# EAGLE design exp31ac (EAGLE 7.7.0)
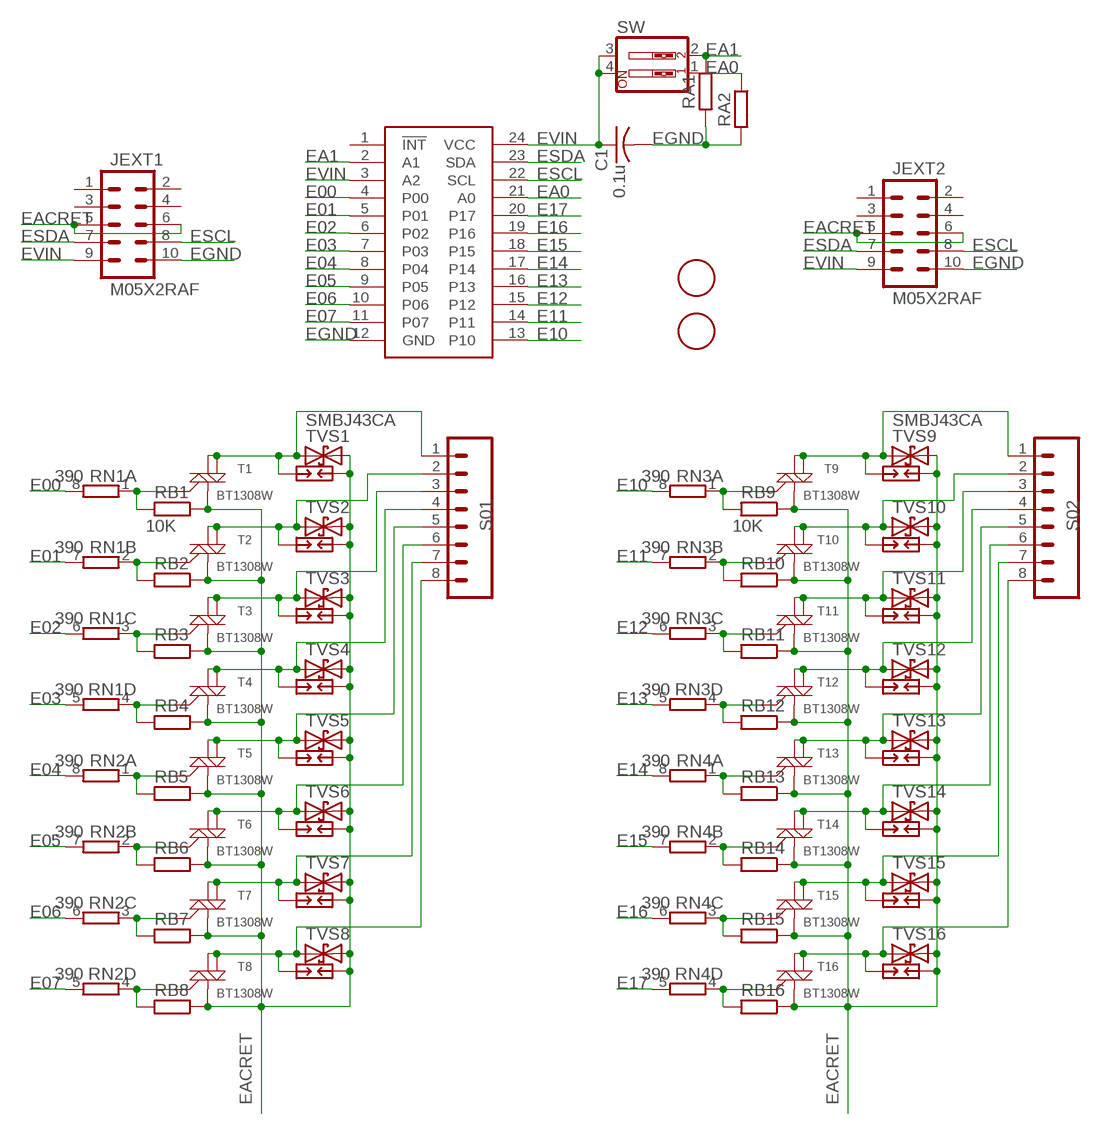
[diagram p0: schematic, sheet 1]

## Parts
C1  0.1u  C-USC0603  [C0603]
JEXT1  M05X2RAF  [2X5-RAF]
JEXT2  M05X2RAF  [2X5-RAF]
PCA9555  PCA9555PW  PCF8575TSSOP24  [TSSOP24]
RA1  10K  R-EU_R0603  [R0603]
RA2  10K  R-EU_R0603  [R0603]
RB1  10K  R-EU_R0603  [R0603]
RB2  10K  R-EU_R0603  [R0603]
RB3  10K  R-EU_R0603  [R0603]
RB4  10K  R-EU_R0603  [R0603]
RB5  10K  R-EU_R0603  [R0603]
RB6  10K  R-EU_R0603  [R0603]
RB7  10K  R-EU_R0603  [R0603]
RB8  10K  R-EU_R0603  [R0603]
RB9  10K  R-EU_R0603  [R0603]
RB10  10K  R-EU_R0603  [R0603]
RB11  10K  R-EU_R0603  [R0603]
RB12  10K  R-EU_R0603  [R0603]
RB13  10K  R-EU_R0603  [R0603]
RB14  10K  R-EU_R0603  [R0603]
RB15  10K  R-EU_R0603  [R0603]
RB16  10K  R-EU_R0603  [R0603]
RN1  390  4R-NEXB38V  [EXB38V]
RN2  390  4R-NEXB38V  [EXB38V]
RN3  390  4R-NEXB38V  [EXB38V]
RN4  390  4R-NEXB38V  [EXB38V]
S01  M085MM-8  [SCREWTERMINAL-5MM-8]
S02  M085MM-8  [SCREWTERMINAL-5MM-8]
SP1  PCB-SGAP  [PCB-SGAP]
SP2  PCB-SGAP  [PCB-SGAP]
SP3  PCB-SGAP  [PCB-SGAP]
SP4  PCB-SGAP  [PCB-SGAP]
SP5  PCB-SGAP  [PCB-SGAP]
SP6  PCB-SGAP  [PCB-SGAP]
SP7  PCB-SGAP  [PCB-SGAP]
SP8  PCB-SGAP  [PCB-SGAP]
SP9  PCB-SGAP  [PCB-SGAP]
SP10  PCB-SGAP  [PCB-SGAP]
SP11  PCB-SGAP  [PCB-SGAP]
SP12  PCB-SGAP  [PCB-SGAP]
SP13  PCB-SGAP  [PCB-SGAP]
SP14  PCB-SGAP  [PCB-SGAP]
SP15  PCB-SGAP  [PCB-SGAP]
SP16  PCB-SGAP  [PCB-SGAP]
SW  SW_DIP-2  [DIPSWITCH-02]
T1  BT1308W  MAC97SOT223  [SOT223]
T2  BT1308W  MAC97SOT223  [SOT223]
T3  BT1308W  MAC97SOT223  [SOT223]
T4  BT1308W  MAC97SOT223  [SOT223]
T5  BT1308W  MAC97SOT223  [SOT223]
T6  BT1308W  MAC97SOT223  [SOT223]
T7  BT1308W  MAC97SOT223  [SOT223]
T8  BT1308W  MAC97SOT223  [SOT223]
T9  BT1308W  MAC97SOT223  [SOT223]
T10  BT1308W  MAC97SOT223  [SOT223]
T11  BT1308W  MAC97SOT223  [SOT223]
T12  BT1308W  MAC97SOT223  [SOT223]
T13  BT1308W  MAC97SOT223  [SOT223]
T14  BT1308W  MAC97SOT223  [SOT223]
T15  BT1308W  MAC97SOT223  [SOT223]
T16  BT1308W  MAC97SOT223  [SOT223]
TVS1  SMBJ43CA  TVSSMB  [SMB]
TVS2  SMBJ43CA  TVSSMB  [SMB]
TVS3  SMBJ43CA  TVSSMB  [SMB]
TVS4  SMBJ43CA  TVSSMB  [SMB]
TVS5  SMBJ43CA  TVSSMB  [SMB]
TVS6  SMBJ43CA  TVSSMB  [SMB]
TVS7  SMBJ43CA  TVSSMB  [SMB]
TVS8  SMBJ43CA  TVSSMB  [SMB]
TVS9  SMBJ43CA  TVSSMB  [SMB]
TVS10  SMBJ43CA  TVSSMB  [SMB]
TVS11  SMBJ43CA  TVSSMB  [SMB]
TVS12  SMBJ43CA  TVSSMB  [SMB]
TVS13  SMBJ43CA  TVSSMB  [SMB]
TVS14  SMBJ43CA  TVSSMB  [SMB]
TVS15  SMBJ43CA  TVSSMB  [SMB]
TVS16  SMBJ43CA  TVSSMB  [SMB]
U$1  FIDUCIAL  [FIDUCIAL_1MM]
U$2  FIDUCIAL  [FIDUCIAL_1MM]

## Nets
E00: PCA9555.4(P00) RN1.8
E01: PCA9555.5(P01) RN1.7
E02: PCA9555.6(P02) RN1.6
E03: PCA9555.7(P03) RN1.5
E04: PCA9555.8(P04) RN2.8
E05: PCA9555.9(P05) RN2.7
E06: PCA9555.10(P06) RN2.6
E07: PCA9555.11(P07) RN2.5
E10: PCA9555.13(P10) RN3.8
E11: PCA9555.14(P11) RN3.7
E12: PCA9555.15(P12) RN3.6
E13: PCA9555.16(P13) RN3.5
E14: PCA9555.17(P14) RN4.8
E15: PCA9555.18(P15) RN4.7
E16: PCA9555.19(P16) RN4.6
E17: PCA9555.20(P17) RN4.5
EA0: PCA9555.21(A0) RA2.1 SW.1
EA1: PCA9555.2(A1) RA1.1 SW.2
EACRET: JEXT1.5 JEXT1.6 JEXT2.5 JEXT2.6 RB1.1 RB2.1 RB3.1 RB4.1 RB5.1 RB6.1 RB7.1 RB8.1 RB9.1 RB10.1 RB11.1 RB12.1 RB13.1 RB14.1 RB15.1 RB16.1 SP1.1 SP2.1 SP3.1 SP4.1 SP5.1 SP6.1 SP7.1 SP8.1 SP9.1 SP10.1 SP11.1 SP12.1 SP13.1 SP14.1 SP15.1 SP16.1 T1.1(M1) T2.1(M1) T3.1(M1) T4.1(M1) T5.1(M1) T6.1(M1) T7.1(M1) T8.1(M1) T9.1(M1) T10.1(M1) T11.1(M1) T12.1(M1) T13.1(M1) T14.1(M1) T15.1(M1) T16.1(M1) TVS1.C TVS2.C TVS3.C TVS4.C TVS5.C TVS6.C TVS7.C TVS8.C TVS9.C TVS10.C TVS11.C TVS12.C TVS13.C TVS14.C TVS15.C TVS16.C
EGND [power]: C1.2 JEXT1.10 JEXT2.10 PCA9555.12(GND) RA1.2 RA2.2
ESCL: JEXT1.8 JEXT2.8 PCA9555.22(SCL)
ESDA: JEXT1.7 JEXT2.7 PCA9555.23(SDA)
EVIN [power]: C1.1 JEXT1.9 JEXT2.9 PCA9555.3(A2) PCA9555.24(VCC) SW.3 SW.4
N$1: RB9.2 RN3.1 T9.3(G)
N$8: RB1.2 RN1.1 T1.3(G)
N$9: RB2.2 RN1.2 T2.3(G)
N$15: RB3.2 RN1.3 T3.3(G)
N$16: RB4.2 RN1.4 T4.3(G)
N$17: RB10.2 RN3.2 T10.3(G)
N$18: RB5.2 RN2.1 T5.3(G)
N$19: RB6.2 RN2.2 T6.3(G)
N$21: RB7.2 RN2.3 T7.3(G)
N$22: RB8.2 RN2.4 T8.3(G)
N$24: RB11.2 RN3.3 T11.3(G)
N$26: RB12.2 RN3.4 T12.3(G)
N$27: RB13.2 RN4.1 T13.3(G)
N$28: RB14.2 RN4.2 T14.3(G)
N$29: RB15.2 RN4.3 T15.3(G)
N$30: RB16.2 RN4.4 T16.3(G)
N$33 [power]: S02.1 SP9.2 T9.2(M2) T9.4(M2-4) TVS9.A
N$34 [power]: S02.2 SP10.2 T10.2(M2) T10.4(M2-4) TVS10.A
N$35 [power]: S02.3 SP11.2 T11.2(M2) T11.4(M2-4) TVS11.A
N$36 [power]: S02.4 SP12.2 T12.2(M2) T12.4(M2-4) TVS12.A
N$37 [power]: S02.5 SP13.2 T13.2(M2) T13.4(M2-4) TVS13.A
N$38 [power]: S02.6 SP14.2 T14.2(M2) T14.4(M2-4) TVS14.A
N$39 [power]: S02.7 SP15.2 T15.2(M2) T15.4(M2-4) TVS15.A
N$40 [power]: S02.8 SP16.2 T16.2(M2) T16.4(M2-4) TVS16.A
N$50 [power]: S01.1 SP1.2 T1.2(M2) T1.4(M2-4) TVS1.A
N$51 [power]: S01.2 SP2.2 T2.2(M2) T2.4(M2-4) TVS2.A
N$52 [power]: S01.3 SP3.2 T3.2(M2) T3.4(M2-4) TVS3.A
N$53 [power]: S01.4 SP4.2 T4.2(M2) T4.4(M2-4) TVS4.A
N$54 [power]: S01.5 SP5.2 T5.2(M2) T5.4(M2-4) TVS5.A
N$55 [power]: S01.6 SP6.2 T6.2(M2) T6.4(M2-4) TVS6.A
N$56 [power]: S01.7 SP7.2 T7.2(M2) T7.4(M2-4) TVS7.A
N$57 [power]: S01.8 SP8.2 T8.2(M2) T8.4(M2-4) TVS8.A
Unconnected: JEXT1.1 JEXT1.2 JEXT1.3 JEXT1.4 JEXT2.1 JEXT2.2 JEXT2.3 JEXT2.4 PCA9555.1(!INT)

## Library data of the parts
C1 = adafruit:C-US: CAPACITOR, American symbol
JEXT1 JEXT2 = SparkFunNew:M05X2: Header 5x2 Standard 10-pin dual row 0.1" header. Commonly used with AVR-ISP. Use with Spark Fun Electronics SKU: PRT-00778
PCA9555 = SparkFunNew:PCF8575
RA1 RA2 RB1-RB16 = rcl:R-EU_: RESISTOR, European symbol
RN1-RN4 = resistor-dil:4R-N: Array Chip Resistor Source: RS Component / Phycomp; OC_FARNELL: unknown; OC_NEWARK: unknown
S01 S02 = SparkFun:M08: Header 8 Standard 8-pin 0.1" header. Use with straight break away headers (SKU : PRT-00116), right angle break away headers (PRT-00553), swiss pins (PRT-00743), machine pins (PRT-00117), and female headers (PRT-00115).
SP1-SP16 = varistor:PCB-SGAP
SW = SparkFun:SW_DIP-2: DIP SWITCH
T1-T16 = SparkFun:MAC97: MAC97 Triac http://www.onsemi.com/pub_link/Collateral/MAC97-D.PDF
TVS1-TVS16 = SparkFunNew:TVS
U$1 U$2 = adafruitGood:FIDUCIAL: For use by pick and place machines to calibrate the vision/machine, 1mm By microbuilder.eu

## Net classes
0 default: width 0.203 mm, clearance 0.178 mm
1 power: width 0.203 mm, clearance 0.178 mm
2 relaypower: width 0.508 mm, clearance 0.508 mm

## Board
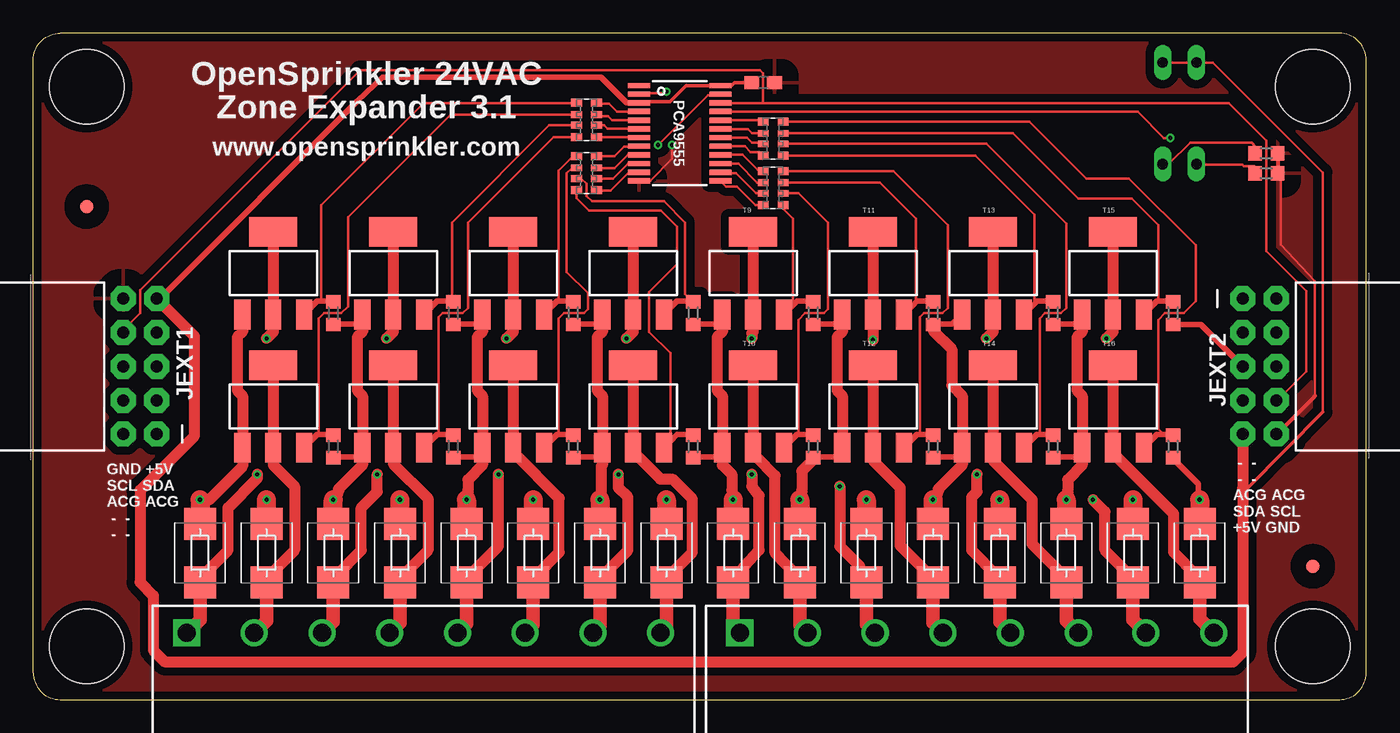
[diagram p1: board, top side]
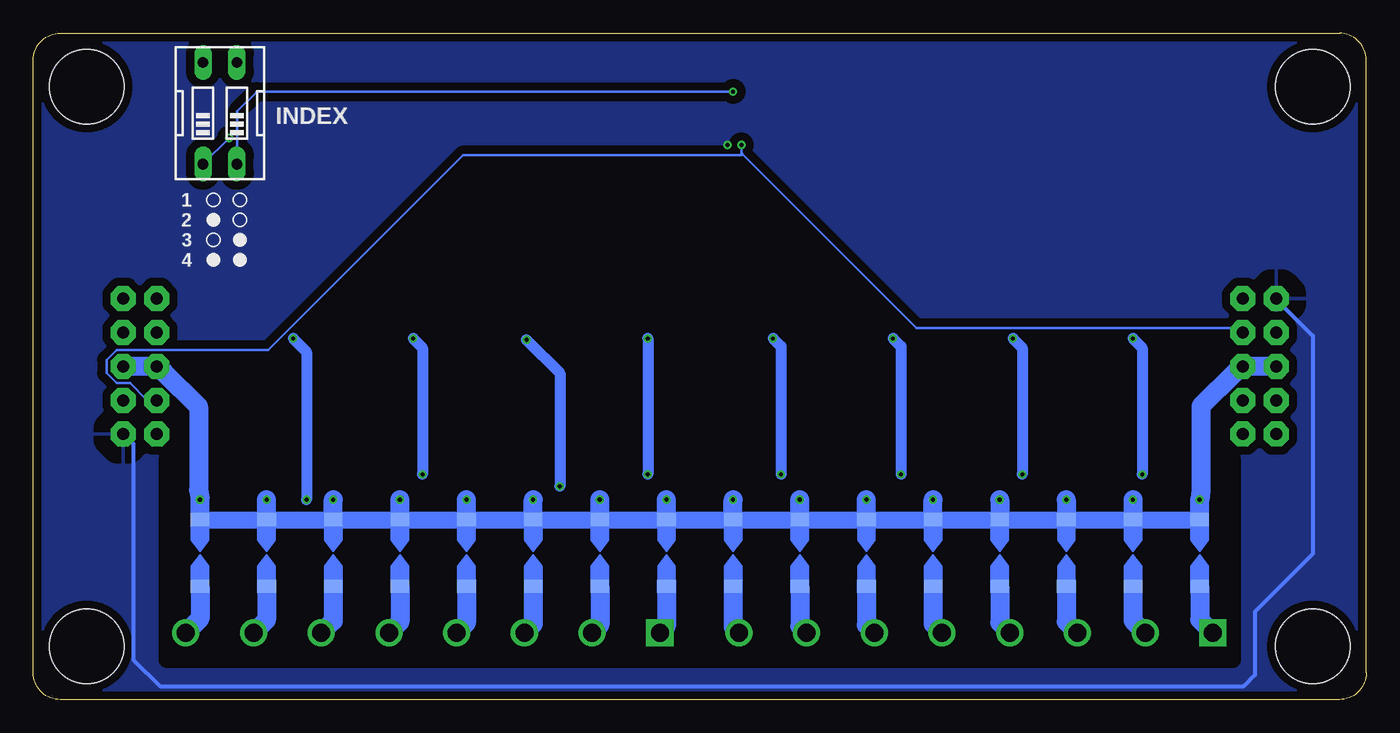
[diagram p2: board, bottom side, seen from below]

Size 100 x 50 mm. Coordinates in mm from the lower left corner, seen from the top.
Outline: 2,0 98,0 arc90 100,2 100,48 arc90 98,50 2,50 arc90 0,48 0,2 arc90 2,0
Copper layers (1*16): Top 0.035mm / dielectric 1.5mm / Bottom 0.035mm
Design rules "Fusion_eagle_rule_v1.1 *": minimum track width 6mil, minimum drill 12mil, track to track 6mil, track to pad 6mil, pad to pad 6mil, via to via 6mil, smd to smd 0mil, copper to edge 10mil, drill to drill 10mil, minimum pad ring 10mil, minimum via ring 6mil, stop-mask expansion 2mil, vias tented up to drill 100mil, thermal gap 50mil
Holes 5.6 mm at 4,4 96,4 4,46 96,46
bRestrict: area 10,3 to 90,18

### Footprints (pad centres in the part's own frame; a part is rotated, then mirrored left to right if it is on the bottom)
C0603 = smd 1.1 x 1: 1 -0.85,0; 2 0.85,0
2X5-RAF = drill 0.9 pad 1.88 octagon: 1 -1.27,5.08; 2 1.27,5.08; 3 -1.27,2.54; 4 1.27,2.54; 5 -1.27,0; 6 1.27,0; 7 -1.27,-2.54; 8 1.27,-2.54; 9 -1.27,-5.08; 10 1.27,-5.08
TSSOP24 = smd 0.4 x 1.65: 1 -3.575,-3.05; 2 -2.925,-3.05; 3 -2.275,-3.05; 4 -1.625,-3.05; 5 -0.975,-3.05; 6 -0.325,-3.05; 7 0.325,-3.05; 8 0.975,-3.05; 9 1.625,-3.05; 10 2.275,-3.05; 11 2.925,-3.05; 12 3.575,-3.05; 13 3.575,3.05; 14 2.925,3.05; 15 2.275,3.05; 16 1.625,3.05; 17 0.975,3.05; 18 0.325,3.05; 19 -0.325,3.05; 20 -0.975,3.05; 21 -1.625,3.05; 22 -2.275,3.05; 23 -2.925,3.05; 24 -3.575,3.05
R0603 = smd 1 x 1.1: 1 -0.85,0; 2 0.85,0
EXB38V = smd 0.6 x 0.8: 1 -1.275,-0.75; 4 1.275,-0.75; 5 1.275,0.75; 8 -1.275,0.75 | smd 0.5 x 0.8: 2 -0.4,-0.75; 3 0.4,-0.75; 6 0.4,0.75; 7 -0.4,0.75
SCREWTERMINAL-5MM-8 = drill 1.35 pad 2.032 square: 1 0,0 | drill 1.35 pad 2.032: 2 5.08,0; 3 10.16,0; 4 15.24,0; 5 20.32,0; 6 25.4,0; 7 30.48,0; 8 35.56,0
PCB-SGAP = smd 1 x 1.4 bottom: 1 -2.5,0; 2 2.5,0
DIPSWITCH-02 = drill 0.813 long: 1 -1.27,-3.81; 2 1.27,-3.81; 3 1.27,3.81; 4 -1.27,3.81
SOT223 = smd 1.219 x 2.235: 1 -2.311,-3.099; 2 0,-3.099; 3 2.311,-3.099 | smd 3.6 x 2.2: 4 0,3.099
SMB = smd 2.4 x 2.4: A 2.2,0; C -2.2,0
FIDUCIAL_1MM = smd 1 x 1: 1 0,0

### Placement (x,y rotation side)
C1  54.75,46.3 0 top
JEXT1  8,25 180 top
JEXT2  92,25 0 top
PCA9555  48.5,42.5 270 top
RA1  92.5,41 0 top
RA2  92.5,39.5 0 top
RB1  22.5,29 90 top
RB2  22.5,19 90 top
RB3  31.5,29 90 top
RB4  31.5,19 90 top
RB5  40.5,29 90 top
RB6  40.5,19 90 top
RB7  49.5,29 90 top
RB8  49.5,19 90 top
RB9  58.5,29 90 top
RB10  58.5,19 90 top
RB11  67.5,29 90 top
RB12  67.5,19 90 top
RB13  76.5,29 90 top
RB14  76.5,19 90 top
RB15  85.5,29 90 top
RB16  85.5,19 90 top
RN1  41.5,43.5 270 top
RN2  41.5,39.5 270 top
RN3  55.5,38.4 90 top
RN4  55.5,42.1 90 top
S01  11.5,5 0 top
S02  53,5 0 top
SP1  12.5,11 270 top
SP2  17.5,11 270 top
SP3  22.5,11 270 top
SP4  27.5,11 270 top
SP5  32.5,11 270 top
SP6  37.5,11 270 top
SP7  42.5,11 270 top
SP8  47.5,11 270 top
SP9  52.5,11 270 top
SP10  57.5,11 270 top
SP11  62.5,11 270 top
SP12  67.5,11 270 top
SP13  72.5,11 270 top
SP14  77.5,11 270 top
SP15  82.5,11 270 top
SP16  87.5,11 270 top
SW  86,44 0 bottom
T1  18,32 0 top
T2  18,22 0 top
T3  27,32 0 top
T4  27,22 0 top
T5  36,32 0 top
T6  36,22 0 top
T7  45,32 0 top
T8  45,22 0 top
T9  54,32 0 top
T10  54,22 0 top
T11  63,32 0 top
T12  63,22 0 top
T13  72,32 0 top
T14  72,22 0 top
T15  81,32 0 top
T16  81,22 0 top
TVS1  12.5,11 270 top
TVS2  17.5,11 270 top
TVS3  22.5,11 270 top
TVS4  27.5,11 270 top
TVS5  32.5,11 270 top
TVS6  37.5,11 270 top
TVS7  42.5,11 270 top
TVS8  47.5,11 270 top
TVS9  52.5,11 270 top
TVS10  57.5,11 270 top
TVS11  62.5,11 270 top
TVS12  67.5,11 270 top
TVS13  72.5,11 270 top
TVS14  77.5,11 270 top
TVS15  82.5,11 270 top
TVS16  87.5,11 270 top
U$1  4,37 0 top
U$2  96,10 0 top

### Tracks (layer width: path | path; a pad name or v marks a point on that pad's centre or on a via)
E00
  Top 0.203: PCA9555.4 43.77,44.12 43.2,44.7 42.33,44.7 RN1.8
E01
  Top 0.203: 45.45,43.5 44.85,43.5 | 44.85,43.5 PCA9555.5 | 44.85,43.5 43.4,43.5 43.1,43.8 42.35,43.8 RN1.7
E02
  Top 0.203: PCA9555.6 43.08,42.83 42.8,43.1 RN1.6
E03
  Top 0.203: PCA9555.7 45.4,42.2 42.3,42.2 RN1.5
E04
  Top 0.203: PCA9555.8 45.4,41.5 44.3,41.5 43.6,40.8 42.3,40.8 RN2.8
E05
  Top 0.203: RN2.7 43.6,39.9 44.6,40.9 45.4,40.9 PCA9555.9
E06
  Top 0.203: RN2.6 43.5,39.1 44.6,40.2 45.4,40.2 PCA9555.10
E07
  Top 0.203: PCA9555.11 45.4,39.6 44.7,39.6 43.3,38.2 42.3,38.2 RN2.5
E10
  Top 0.203: RN3.8 54.17,37.12 52.8,38.5 51.98,38.5 PCA9555.13
E11
  Top 0.203: RN3.7 54.2,38 52.7,39.5 51.62,39.5 PCA9555.14
E12
  Top 0.203: RN3.6 54.3,38.8 52.9,40.2 51.58,40.2 PCA9555.15
E13
  Top 0.203: RN3.5 54.42,39.67 53.2,40.9 51.58,40.9 PCA9555.16
E14
  Top 0.203: PCA9555.17 53.38,41.52 53.8,41.1 54.48,41.1 RN4.8
E15
  Top 0.203: PCA9555.18 53.52,42.17 53.9,41.8 54.65,41.8 RN4.7
E16
  Top 0.203: RN4.6 53.9,42.5 53.6,42.8 51.58,42.8 PCA9555.19
E17
  Top 0.203: PCA9555.20 54.65,43.48 RN4.5
EA0  (via drill 0.3)
  Top 0.203: PCA9555.21 82.75,44.12 82.85,44.1 84.8,42.15 v85.3,42.15 | RA2.1 91.65,40 91.6,40.05 90.8,40.05 90.7,40.15 87.3,40.15 SW.1
  Bottom 0.203: v85.3,42.15 87.25,40.2 SW.1
EA1  (via drill 0.3)
  Top 0.203: v47.5,45.62 47.38,45.5 45.5,45.5 PCA9555.2 | RA1.1 91.65,41.55 91.4,41.8 86.8,41.8 85.2,40.2 84.75,40.2 SW.2
  Bottom 0.203: v47.5,45.62 83.25,45.62 83.3,45.55 84.7,44.15 84.7,40.2 SW.2
EACRET  (via drill 0.3)
  Top 0.406: T3.1 24.3,28.2 22.5,28.2 RB1.1 | T4.1 24.3,18.2 22.5,18.2 RB2.1 | T5.1 33.3,28.2 31.5,28.2 RB3.1 | T6.1 33.3,18.2 31.5,18.2 RB4.1 | T7.1 42.3,28.2 40.5,28.2 RB5.1 | T8.1 42.3,18.2 40.5,18.2 RB6.1 | T9.1 51.3,28.2 49.5,28.2 RB7.1 | T10.1 51.3,18.2 49.5,18.2 RB8.1 | T11.1 60.3,28.2 58.5,28.2 RB9.1 | T12.1 60.3,18.2 58.5,18.2 RB10.1 | T13.1 69.6,28.9 68.9,28.2 67.9,28.2 RB11.1 | T14.1 69.3,18.2 67.5,18.2 RB12.1 | T15.1 78.3,28.2 76.5,28.2 RB13.1 | T16.1 78.3,18.2 76.5,18.2 RB14.1 | v87.5,15 87.4,15.7 87.4,16.2 85.5,18.1 RB16.1 | RB15.1 87.58,28.15 JEXT2.5
  Top 0.813: T1.1 15.7,27.6 15.3,27.2 15.3,23.2 15.7,22.8 15.7,19 T2.1 15.7,18.5 15.7,17.5 13.2,15 v12.5,15 | T3.1 24.7,27.6 24.3,27.2 24.3,23.2 24.7,22.8 24.7,19 T4.1 24.7,18.5 24.7,17.6 22.9,15.8 22.9,15.6 v22.5,15 | T5.1 33.7,27.6 33.3,27.2 33.3,23.2 33.7,22.8 33.7,19 T6.1 33.7,18.5 33.7,17.6 32.6,16.5 32.6,15.7 v32.5,15 | T7.1 42.7,27.6 42.3,27.2 42.3,23.2 42.7,22.8 42.7,19 T8.1 42.7,18.5 42.7,17.6 42.6,17.5 42.6,15.7 v42.5,15 | T9.1 51.7,27.6 51.3,27.2 51.3,23.2 51.7,22.8 51.7,19 T10.1 51.7,18.5 51.7,17.6 52.4,16.9 52.4,15.7 v52.5,15 | T12.1 60.7,19 60.7,22.8 60.3,23.2 60.3,27.2 60.7,27.6 T11.1 | RB11.1 67.5,27.7 68.9,26.3 68.9,23.6 69.7,22.8 69.7,19 T14.1 69.7,18.5 69.7,17.6 67.9,15.8 67.9,15.6 v67.5,15 | T15.1 78.7,27.6 78.3,27.2 78.3,23.2 78.7,22.8 78.7,19 T16.1 78.7,18.5 78.7,17.6 77.6,16.5 77.6,15.7 v77.5,15 | v57.5,15 57.65,15.7 57.65,17.15 58.45,17.95 RB10.1
  Top 1.422: v12.5,15 TVS1.C | TVS2.C v17.5,15 | TVS3.C v22.5,15 | TVS4.C v27.5,15 | v32.5,15 TVS5.C | v37.5,15 TVS6.C | v42.5,15 TVS7.C | v47.5,15 TVS8.C | v52.5,15 TVS9.C | v57.5,15 TVS10.C | v67.5,15 TVS12.C | v72.5,15 TVS13.C | v77.5,15 TVS14.C | v82.5,15 TVS15.C | v87.5,15 TVS16.C | v62.5,15 TVS11.C
  Bottom 1.27: SP1.1 SP2.1 SP3.1 SP4.1 SP5.1 SP6.1 SP7.1 SP8.1 SP9.1 SP10.1 SP11.1 SP12.1 SP13.1 SP14.1 SP15.1 SP16.1
  Bottom 1.422: SP1.1 v12.5,15 12.4,15.7 12.4,22 9.8,24.6 JEXT1.5 JEXT1.6 | v17.5,15 SP2.1 | v22.5,15 SP3.1 22.5,13 | v27.5,15 SP4.1 | SP5.1 v32.5,15 | SP6.1 v37.5,15 | SP7.1 v42.5,15 | SP8.1 v47.5,15 | SP9.1 v52.5,15 | SP10.1 v57.5,15 | SP12.1 v67.5,15 | SP13.1 v72.5,15 | SP14.1 v77.5,15 | SP15.1 v82.5,15 | SP16.1 v87.5,15 87.6,15.7 87.6,22 90.2,24.6 JEXT2.5 JEXT2.6 | SP11.1 v62.5,15
EGND  (via drill 0.3)
  Top 0.203: 96.15,22.8 96.15,31.4 93.6,34.15 93.6,39.25 RA2.2 | v47.91,41.62 47.91,40.58 46.29,38.96 45.53,38.96 PCA9555.12
  Top 0.254: 6.75,30.12 JEXT1.10
  Top 0.305: RA1.2 RA2.2 | 96.15,22.8 96.1,22.7 93.3,19.9 JEXT2.10
  Bottom 0.203: v47.91,41.62 47.92,41.71
  Bottom 0.305: JEXT2.10 93.2,19.9 92.5,19.2 92.5,3 90.5,1 9.2,1 8.35,1.85 8.35,6.6 4,10.95 4,27.3 6.7,30 JEXT1.10
  pour Top (isolate 0.61): 0,50 99.36,50 100,49.37 100,0 0.64,0 0,0.64
  pour Bottom (isolate 0.61): 0,50 99.36,50 100,49.37 100,0 0.64,0 0,0.64
ESCL
  Top 0.203: PCA9555.22 51.62,44.75 54.75,44.75 | JEXT2.8 93.38,22.5 95.5,24.62 95.5,30.65 92.5,33.65 92.5,41.95 89.7,44.75 54.75,44.75 | 54.75,44.75 54.75,47 54.5,47.25 24.5,47.25 8,30.75 8,29 6.75,27.75 JEXT1.8
ESDA  (via drill 0.3)
  Top 0.203: v46.88,41.62 50.62,45.38 51.5,45.38 PCA9555.23
  Bottom 0.203: v46.88,41.62 46.88,41 46.81,40.94 | 46.81,40.94 33.75,27.88 9.62,27.88 9.38,27.62 JEXT1.7 | JEXT2.7 90.75,22.5 91.5,22.5 92.75,23.75 93.75,23.75 94.5,24.5 94.5,25.5 93.75,26.25 82.38,26.25 67.75,40.88 46.88,40.88 46.81,40.94
EVIN
  Top 0.203: 96.75,21.6 96.75,39.55 88.5,47.8 87.9,47.8 SW.4 | 87.3,47.8 SW.4 | SW.4 87.2,47.8 84.75,47.8 SW.3
  Top 0.254: 52.12,46.12 PCA9555.24 | 96.75,21.6 91.12,15.88 90.73,15.88 | 45.38,44.75 PCA9555.3 45.5,44.88 47.75,44.88 48.95,46.08 PCA9555.24 | 9.62,30.25 JEXT1.9 | C1.1 52.6,46.3 52.4,46.1 52.2,46.1 PCA9555.24
  Top 0.406: 9.62,30.25 9.65,30.25 24.3,44.9 26.2,46.7 42.6,46.7 44.5,44.8 45.3,44.8 PCA9555.3 45.42,44.8
  Top 0.813: JEXT2.9 90.73,15.88 90.73,3.53 90,2.8 9.9,2.8 9,3.7 9,7.8 8,8.8 8,15.7 12.1,19.8 12.1,27.25 JEXT1.9
N$1
  Top 0.203: RN3.1 56.25,36.85 57,36.1 57,29.8 57.1,29.7
  Top 0.406: T9.3 56.4,29 57.1,29.7 57.3,29.9 58.3,29.9 RB9.2
N$8
  Top 0.203: RN1.1 29.27,44.77 21.6,37.1 21.6,30.1 21.8,29.9
  Top 0.406: T1.3 20.4,29 21.3,29.9 21.8,29.9 22.3,29.9 RB1.2
N$9
  Top 0.203: RN1.2 31.3,43.9 23.6,36.2 23.6,29.5 23.1,29 21.8,29 21.4,28.6 21.4,19.9
  Top 0.406: T2.3 20.4,19 21.3,19.9 21.4,19.9 22.3,19.9 RB2.2
N$15
  Top 0.203: RN1.3 38.7,43.1 31.4,35.8 31.4,29.95 RB3.2
  Top 0.406: T3.3 29.4,29 30.3,29.9 31.3,29.9 RB3.2
N$16
  Top 0.203: RN1.4 39.02,42.23 32.6,35.8 32.6,29.4 32.2,29 30.7,29 30.4,28.7 30.4,20 30.5,19.9
  Top 0.406: T4.3 29.4,19 30.3,19.9 30.5,19.9 31.3,19.9 RB4.2
N$17
  Top 0.203: RN3.2 57.4,38 59.6,35.8 59.6,29.3 59.3,29 57.9,29 57.4,28.5 57.4,20 57.3,19.9
  Top 0.406: T10.3 56.4,19 57.3,19.9 58.3,19.9 RB10.2
N$18
  Top 0.203: RN2.1 40.48,40.77 39.4,39.7 39.4,30 39.3,29.9
  Top 0.406: T5.3 38.4,29 39.3,29.9 40.3,29.9 RB5.2
N$19
  Top 0.203: RN2.2 40.4,39.9 40,39.5 40,32.1 41.6,30.5 41.6,29.3 41.3,29 39.8,29 39.4,28.6 39.4,20.1 39.6,19.9
  Top 0.406: T6.3 38.4,19 39.3,19.9 39.6,19.9 40.3,19.9 RB6.2
N$21
  Top 0.203: RN2.3 41.1,39.1 41.5,38.7 41.5,37.8 41.9,37.4 47.3,37.4 48.9,35.8 48.9,30.45 RB7.2
  Top 0.406: T7.3 47.4,29 48.3,29.9 49.3,29.9 RB7.2
N$22
  Top 0.203: RN2.4 40.75,37.65 41.7,36.7 47.1,36.7 48.3,35.5 48.3,32.7 46.2,30.6 46.2,27.6 47.8,26 47.8,19.4 47.75,19.35
  Top 0.406: T8.3 47.4,19 47.75,19.35 48.3,19.9 49.3,19.9 RB8.2
N$24
  Top 0.203: RN3.3 63.5,38.8 66.2,36.1 66.2,29.8 65.95,29.55
  Top 0.406: T11.3 65.4,29 65.95,29.55 66.3,29.9 67.3,29.9 RB11.2
N$26
  Top 0.203: RN3.4 64.53,39.67 68.6,35.6 68.6,29.4 68.2,29 66.8,29 66.5,28.7 66.5,20.1 66.3,19.9
  Top 0.406: T12.3 65.4,19 66.3,19.9 67.3,19.9 RB12.2
N$27
  Top 0.203: RN4.1 70.67,40.83 75.1,36.4 75.1,29.9 75.2,29.8
  Top 0.406: T13.3 74.4,29 75.2,29.8 75.3,29.9 76.3,29.9 RB13.2
N$28
  Top 0.203: RN4.2 71.5,41.7 77.5,35.7 77.5,29.4 77.1,29 75.9,29 75.5,28.6 75.5,20.1 75.3,19.9
  Top 0.406: T14.3 74.4,19 75.3,19.9 76.3,19.9 RB14.2
N$29
  Top 0.203: RN4.3 73.5,42.5 78.4,37.6 82.4,37.6 84.4,35.6 84.4,30 84.5,29.9
  Top 0.406: T15.3 83.4,29 84.3,29.9 84.5,29.9 85.3,29.9 RB15.2
N$30
  Top 0.203: RN4.4 74.72,43.38 79,39.1 82.2,39.1 87.2,34.1 87.2,29.9 86.3,29 84.9,29 84.4,28.5 84.4,20.3 84.8,19.9
  Top 0.406: T16.3 83.4,19 84.3,19.9 84.8,19.9 85.3,19.9 RB16.2
N$33  (via drill 0.3)
  Top 0.813: T9.4 T9.2 54,27.6 53.9,27.5 v53.9,27.1 | v53.9,16.9 53.9,16 54.45,15.3 54.45,11.2 52.7,9.3 TVS9.A
  Top 1.016: TVS9.A 52.5,5.5 S02.1
  Bottom 0.813: v53.9,27.1 v53.9,16.9
  Bottom 1.422: SP9.2 52.5,5.5 S02.1
N$34
  Top 0.813: T10.4 T10.2 54,18.3 54.05,18.25 54.2,18.25 55.65,16.8 55.65,11 57.3,9.3 TVS10.A
  Top 1.016: TVS10.A 57.5,5.58 S02.2
  Bottom 1.422: SP10.2 57.5,5.58 S02.2
N$35  (via drill 0.3)
  Top 0.813: T11.4 T11.2 v63,27 | v60.5,16 60.5,11.5 62,10 62,9 TVS11.A
  Top 1.016: TVS11.A 62.5,5.66 S02.3
  Bottom 0.813: v60.5,16 60.5,24.5 v63,27
  Bottom 1.422: SP11.2 62.5,5.66 S02.3
N$36
  Top 0.813: T12.4 T12.2 63,17.95 65.05,15.9 65.05,11.55 67.3,9.3 TVS12.A
  Top 1.016: TVS12.A 67.5,5.74 S02.4
  Bottom 1.422: SP12.2 67.5,5.74 S02.4
N$37  (via drill 0.3)
  Top 0.813: T13.4 T13.2 72,27.6 v71.5,27.1 | v70.8,16.9 70.8,15.6 70.4,15.2 70.4,11.2 72.3,9.3 TVS13.A
  Top 1.016: TVS13.A 72.5,5.82 S02.5
  Bottom 0.813: v70.8,16.9 70.8,26.4 v71.5,27.1
  Bottom 1.422: SP13.2 72.5,5.82 S02.5
N$38
  Top 0.813: T14.4 T14.2 72,17.95 74.95,15 74.95,11.65 77.3,9.3 TVS14.A
  Top 1.016: TVS14.A 77.5,5.9 S02.6
  Bottom 1.422: SP14.2 77.5,5.9 S02.6
N$39  (via drill 0.3)
  Top 0.813: T15.4 T15.2 81,27.6 v80.5,27.1 | v79.5,15 80.4,14.1 80.4,11.2 82.3,9.3 TVS15.A
  Top 1.016: TVS15.A 82.5,5.98 S02.7
  Bottom 0.813: v79.5,15 79.5,26.1 v80.5,27.1
  Bottom 1.422: SP15.2 82.5,5.98 S02.7
N$40
  Top 0.813: T16.4 T16.2 81,18.35 81.05,18.3 81.2,18.3 85.55,13.95 85.55,11.05 87.3,9.3 TVS16.A
  Top 1.016: TVS16.A 87.5,6.06 S02.8
  Bottom 1.422: SP16.2 87.5,6.06 S02.8
N$50  (via drill 0.3)
  Top 0.813: T1.4 T1.2 18,27.6 v17.5,27.1 | v16.8,16.9 16.8,16.6 14.6,14.4 14.6,11.2 12.7,9.3 TVS1.A
  Top 1.016: TVS1.A 12.5,6 S01.1
  Bottom 0.813: v16.8,16.9 16.8,26.4 v17.5,27.1
  Bottom 1.422: SP1.2 12.5,6 S01.1
N$51
  Top 0.813: T2.4 T2.2 18,17.6 19.6,16 19.6,11.2 17.7,9.3 TVS2.A
  Top 1.016: TVS2.A 17.5,5.92 S01.2
  Bottom 1.422: SP2.2 17.5,5.92 S01.2
N$52  (via drill 0.3)
  Top 0.813: T3.4 T3.2 27,27.6 v26.5,27.1 | v25.8,16.9 25.8,15.6 24.6,14.4 24.6,11.2 22.7,9.3 TVS3.A
  Top 1.016: TVS3.A 22.5,5.84 S01.3
  Bottom 0.813: v25.8,16.9 25.8,26.4 v26.5,27.1
  Bottom 1.422: SP3.2 22.5,5.84 S01.3
N$53
  Top 0.813: T4.4 T4.2 27,17.7 29.6,15.1 29.6,11.2 27.7,9.3 TVS4.A
  Top 1.016: TVS4.A 27.5,5.76 S01.4
  Bottom 1.422: SP4.2 27.5,5.76 S01.4
N$54  (via drill 0.3)
  Top 0.813: T5.4 T5.2 36,27.6 v35.5,27.1 | v34.9,16.9 34.9,11.5 32.7,9.3 TVS5.A
  Top 1.016: TVS5.A 32.5,5.68 S01.5
  Bottom 0.813: v34.9,16.9 34.9,26.5 v35.5,27.1
  Bottom 1.422: SP5.2 32.5,5.68 S01.5
N$55
  Top 0.813: T6.4 T6.2 36.05,18.5 39.45,15.1 39.45,11.05 37.7,9.3 TVS6.A
  Top 1.016: TVS6.A 37.5,5.6 S01.6
  Bottom 1.422: SP6.2 37.5,5.6 S01.6
N$56  (via drill 0.3)
  Top 0.813: T7.4 T7.2 45,27.6 v44.5,27.1 | v43.9,16.9 43.9,15.9 44.6,15.2 44.6,11.2 42.7,9.3 TVS7.A
  Top 1.016: TVS7.A 42.5,5.52 S01.7
  Bottom 0.813: v43.9,16.9 43.9,26.5 v44.5,27.1
  Bottom 1.422: SP7.2 42.5,5.52 S01.7
N$57
  Top 0.813: T8.4 T8.2 45.1,18.5 47.05,16.55 47.95,16.55 49.45,15.05 49.45,11.05 47.7,9.3 TVS8.A
  Top 1.016: TVS8.A 47.5,5.44 S01.8
  Bottom 1.422: SP8.2 47.5,5.44 S01.8

### Text on the board
tNames: OpenSprinkler 24VAC | Zone Expander 3.1 | www.opensprinkler.com | GND +5V / SCL SDA / ACG ACG / - - / - - | - - / - - / ACG ACG / SDA SCL / +5V GND
bNames: INDEX | 1 | 2 | 3 | 4